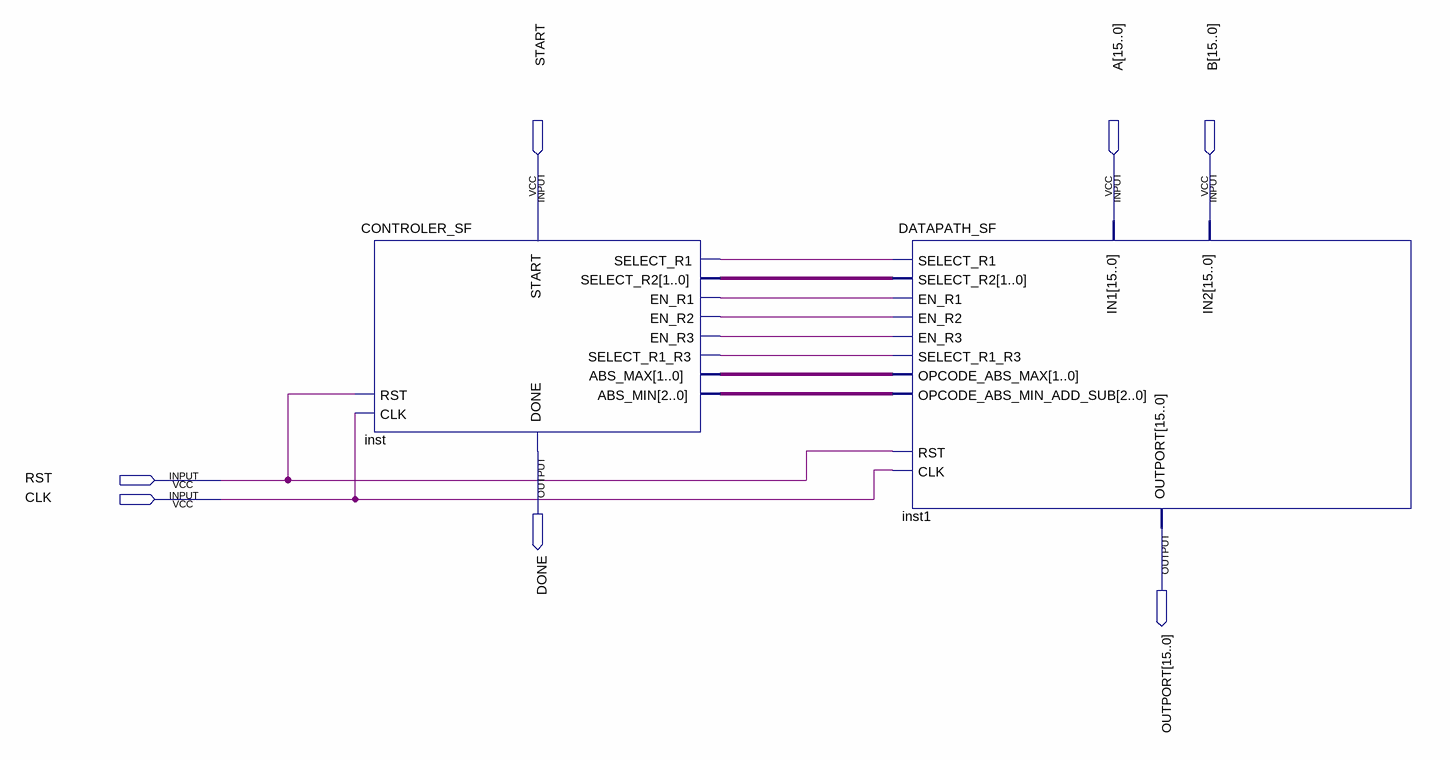
[diagram p0: schematic sheet]
// Quartus schematic SRA_SF.bdf as structural Verilog: 2 symbols, 7 pins
module SRA_SF (
  input  START,
  input  [15:0] A,
  input  [15:0] B,
  input  RST,
  input  CLK,
  output DONE,
  output [15:0] OUTPORT
);

  wire inst_en_r1, inst_en_r2, inst_en_r3, inst_select_r1, inst_select_r1_r3;
  wire [1:0] inst_abs_max, inst_select_r2;
  wire [2:0] inst_abs_min;

  CONTROLER_SF inst (
    .START(START), .CLK(CLK), .RST(RST), .SELECT_R1(inst_select_r1), .SELECT_R2(inst_select_r2),
    .EN_R1(inst_en_r1), .EN_R2(inst_en_r2), .EN_R3(inst_en_r3), .SELECT_R1_R3(inst_select_r1_r3),
    .ABS_MAX(inst_abs_max), .ABS_MIN(inst_abs_min), .DONE(DONE));
  DATAPATH_SF inst1 (
    .SELECT_R1(inst_select_r1), .SELECT_R2(inst_select_r2), .EN_R1(inst_en_r1), .EN_R2(inst_en_r2),
    .EN_R3(inst_en_r3), .SELECT_R1_R3(inst_select_r1_r3), .OPCODE_ABS_MAX(inst_abs_max),
    .OPCODE_ABS_MIN_ADD_SUB(inst_abs_min), .IN1(A), .IN2(B), .RST(RST), .CLK(CLK), .OUTPORT(OUTPORT));
endmodule
